# EAGLE schematic quad_l293d (EAGLE 9.6.2)
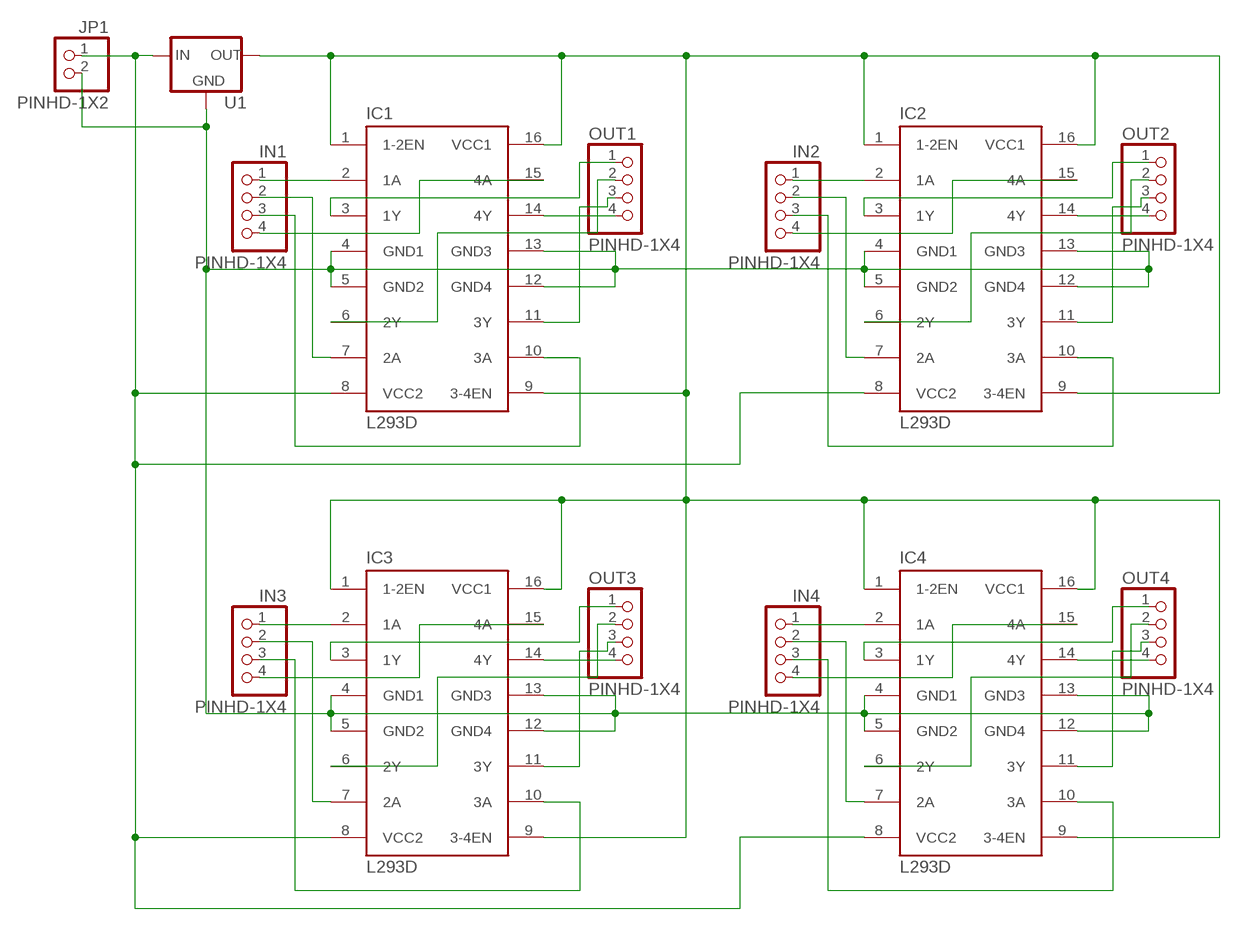
[diagram p0: schematic, sheet 1]

## Parts
IC1  L293D  [DIL16]
IC2  L293D  [DIL16]
IC3  L293D  [DIL16]
IC4  L293D  [DIL16]
IN1  PINHD-1X4  [1X04]
IN2  PINHD-1X4  [1X04]
IN3  PINHD-1X4  [1X04]
IN4  PINHD-1X4  [1X04]
JP1  PINHD-1X2  [1X02]
OUT1  PINHD-1X4  [1X04]
OUT2  PINHD-1X4  [1X04]
OUT3  PINHD-1X4  [1X04]
OUT4  PINHD-1X4  [1X04]
U1  V_REG_78XX-TO-220  [TO-220-ALT]

## Nets
GND: IC1.4(GND1) IC1.5(GND2) IC1.12(GND4) IC1.13(GND3) IC2.4(GND1) IC2.5(GND2) IC2.12(GND4) IC2.13(GND3) IC3.4(GND1) IC3.5(GND2) IC3.12(GND4) IC3.13(GND3) IC4.4(GND1) IC4.5(GND2) IC4.12(GND4) IC4.13(GND3) JP1.2 U1.GND
IN: IC1.8(VCC2) IC2.8(VCC2) IC3.8(VCC2) IC4.8(VCC2) JP1.1 U1.IN
N$2: IC1.3(1Y) OUT1.1
N$3: IC1.14(4Y) OUT1.4
N$4: IC1.2(1A) IN1.1
N$5: IC1.7(2A) IN1.2
N$6: IC1.10(3A) IN1.3
N$7: IC1.15(4A) IN1.4
N$9: IC2.2(1A) IN2.1
N$10: IC2.7(2A) IN2.2
N$11: IC1.6(2Y) OUT1.2
N$12: IC1.11(3Y) OUT1.3
N$13: IC3.2(1A) IN3.1
N$14: IC2.10(3A) IN2.3
N$15: IC2.15(4A) IN2.4
N$16: IC2.3(1Y) OUT2.1
N$17: IC2.14(4Y) OUT2.4
N$18: IC2.6(2Y) OUT2.2
N$19: IC2.11(3Y) OUT2.3
N$20: IC3.7(2A) IN3.2
N$21: IC3.10(3A) IN3.3
N$23: IC3.15(4A) IN3.4
N$24: IC3.3(1Y) OUT3.1
N$25: IC3.14(4Y) OUT3.4
N$26: IC3.6(2Y) OUT3.2
N$27: IC3.11(3Y) OUT3.3
N$28: IC4.2(1A) IN4.1
N$29: IC4.7(2A) IN4.2
N$30: IC4.10(3A) IN4.3
N$31: IC4.15(4A) IN4.4
N$32: IC4.3(1Y) OUT4.1
N$33: IC4.14(4Y) OUT4.4
N$34: IC4.6(2Y) OUT4.2
N$35: IC4.11(3Y) OUT4.3
OUT5V: IC1.1(1-2EN) IC1.9(3-4EN) IC1.16(VCC1) IC2.1(1-2EN) IC2.9(3-4EN) IC2.16(VCC1) IC3.1(1-2EN) IC3.9(3-4EN) IC3.16(VCC1) IC4.1(1-2EN) IC4.9(3-4EN) IC4.16(VCC1) U1.OUT

## Library data of the parts
IC1-IC4 = st-microelectronics:L293D: PUSH-PULL 4 CHANNEL DRIVER; MPN: L293D; OC_FARNELL: 9589619; OC_NEWARK: 56P8249
IN1-IN4 OUT1-OUT4 = Connector:PINHD-1X4: PIN HEADER; CATEGORY: CONNECTOR; SUB-CATEGORY: PIN-HEADER
JP1 = Connector:PINHD-1X2: PIN HEADER; CATEGORY: CONNECTOR; SUB-CATEGORY: PIN-HEADER
U1 = SparkFun-IC-Power:V_REG_78XX: Voltage Regulator Standard 78xx regulator. IGO (Input Ground Output). Spark Fun Electronics SKU : COM-00107; PROD_ID: VREG-08450; SF_ID: COM-00107